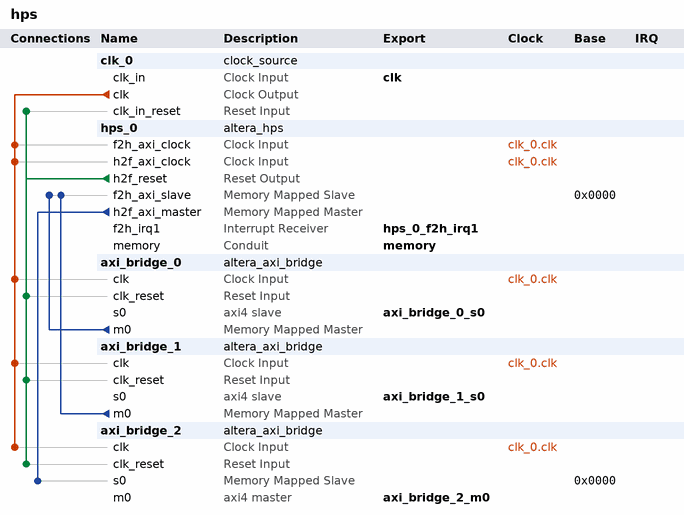
[diagram p0: system contents]
# Platform Designer (Qsys) system hps, Cyclone V 5CSEMA4U23C6
# Parameters at their usual value, and those the tool derives, are not listed.
package require -exact qsys 16.0
create_system hps
set_project_property DEVICE_FAMILY {Cyclone V}
set_project_property DEVICE 5CSEMA4U23C6

add_instance clk_0 clock_source 16.0
set_instance_parameter_value clk_0 clockFrequency 50000000

add_instance hps_0 altera_hps 16.0
set_instance_parameter_value hps_0 EMAC1_Mode N/A
set_instance_parameter_value hps_0 EMAC1_PinMuxing Unused
set_instance_parameter_value hps_0 F2SCLK_COLDRST_Enable false
set_instance_parameter_value hps_0 F2SCLK_DBGRST_Enable false
set_instance_parameter_value hps_0 F2SCLK_WARMRST_Enable false
set_instance_parameter_value hps_0 F2SINTERRUPT_Enable true
set_instance_parameter_value hps_0 F2S_Width 2
set_instance_parameter_value hps_0 FPGA_PERIPHERAL_OUTPUT_CLOCK_FREQ_EMAC0_GTX_CLK 125
set_instance_parameter_value hps_0 FPGA_PERIPHERAL_OUTPUT_CLOCK_FREQ_EMAC0_MD_CLK 2.5
set_instance_parameter_value hps_0 FPGA_PERIPHERAL_OUTPUT_CLOCK_FREQ_EMAC1_GTX_CLK 125
set_instance_parameter_value hps_0 FPGA_PERIPHERAL_OUTPUT_CLOCK_FREQ_EMAC1_MD_CLK 2.5
set_instance_parameter_value hps_0 HPS_PROTOCOL DDR3
set_instance_parameter_value hps_0 I2C0_Mode N/A
set_instance_parameter_value hps_0 I2C0_PinMuxing Unused
set_instance_parameter_value hps_0 I2C1_Mode N/A
set_instance_parameter_value hps_0 I2C1_PinMuxing Unused
set_instance_parameter_value hps_0 LWH2F_Enable false
set_instance_parameter_value hps_0 MEM_BANKADDR_WIDTH 3
set_instance_parameter_value hps_0 MEM_CLK_FREQ 300.0
set_instance_parameter_value hps_0 MEM_CLK_FREQ_MAX 400.0
set_instance_parameter_value hps_0 MEM_COL_ADDR_WIDTH 8
set_instance_parameter_value hps_0 MEM_DQ_WIDTH 32
set_instance_parameter_value hps_0 MEM_DRV_STR RZQ/6
set_instance_parameter_value hps_0 MEM_ROW_ADDR_WIDTH 12
set_instance_parameter_value hps_0 MEM_RTT_NOM {ODT Disabled}
set_instance_parameter_value hps_0 MEM_RTT_WR {Dynamic ODT off}
set_instance_parameter_value hps_0 MEM_TCL 7
set_instance_parameter_value hps_0 MEM_TFAW_NS 37.5
set_instance_parameter_value hps_0 MEM_TINIT_US 499
set_instance_parameter_value hps_0 MEM_TMRD_CK 3
set_instance_parameter_value hps_0 MEM_TRAS_NS 40.0
set_instance_parameter_value hps_0 MEM_TRCD_NS 15.0
set_instance_parameter_value hps_0 MEM_TREFI_US 7.0
set_instance_parameter_value hps_0 MEM_TRFC_NS 75.0
set_instance_parameter_value hps_0 MEM_TRP_NS 15.0
set_instance_parameter_value hps_0 MEM_TWTR 2
set_instance_parameter_value hps_0 MEM_VENDOR JEDEC
set_instance_parameter_value hps_0 MEM_WTCL 6
set_instance_parameter_value hps_0 QSPI_Mode N/A
set_instance_parameter_value hps_0 QSPI_PinMuxing Unused
set_instance_parameter_value hps_0 REF_CLK_FREQ 125.0
set_instance_parameter_value hps_0 S2FCLK_USER2CLK 5
set_instance_parameter_value hps_0 S2F_Width 1
set_instance_parameter_value hps_0 SDIO_Mode N/A
set_instance_parameter_value hps_0 SDIO_PinMuxing Unused
set_instance_parameter_value hps_0 SPIM1_Mode N/A
set_instance_parameter_value hps_0 SPIM1_PinMuxing Unused
set_instance_parameter_value hps_0 STM_Enable false
set_instance_parameter_value hps_0 TIMING_BOARD_AC_SKEW 0.02
set_instance_parameter_value hps_0 TIMING_BOARD_AC_TO_CK_SKEW 0.0
set_instance_parameter_value hps_0 TIMING_BOARD_DQ_TO_DQS_SKEW 0.0
set_instance_parameter_value hps_0 TIMING_BOARD_MAX_CK_DELAY 0.6
set_instance_parameter_value hps_0 TIMING_BOARD_MAX_DQS_DELAY 0.6
set_instance_parameter_value hps_0 TIMING_BOARD_SKEW_BETWEEN_DQS 0.02
set_instance_parameter_value hps_0 TIMING_BOARD_SKEW_CKDQS_DIMM_MAX 0.01
set_instance_parameter_value hps_0 TIMING_BOARD_SKEW_CKDQS_DIMM_MIN -0.01
set_instance_parameter_value hps_0 TIMING_BOARD_SKEW_WITHIN_DQS 0.02
set_instance_parameter_value hps_0 TIMING_TDH 125
set_instance_parameter_value hps_0 TIMING_TDQSCK 400
set_instance_parameter_value hps_0 TIMING_TDQSQ 120
set_instance_parameter_value hps_0 TIMING_TDS 50
set_instance_parameter_value hps_0 TIMING_TIH 250
set_instance_parameter_value hps_0 TIMING_TIS 175
set_instance_parameter_value hps_0 TIMING_TQSH 0.38
set_instance_parameter_value hps_0 UART0_Mode N/A
set_instance_parameter_value hps_0 UART0_PinMuxing Unused
set_instance_parameter_value hps_0 USB1_Mode N/A
set_instance_parameter_value hps_0 USB1_PinMuxing Unused
set_instance_parameter_value hps_0 desired_cfg_clk_mhz 100.0
set_instance_parameter_value hps_0 desired_qspi_clk_mhz 400.0

add_instance axi_bridge_0 altera_axi_bridge 16.0
set_instance_parameter_value axi_bridge_0 ADDR_WIDTH 40
set_instance_parameter_value axi_bridge_0 AXI_VERSION AXI4
set_instance_parameter_value axi_bridge_0 COMBINED_ACCEPTANCE_CAPABILITY 16
set_instance_parameter_value axi_bridge_0 COMBINED_ISSUING_CAPABILITY 16
set_instance_parameter_value axi_bridge_0 DATA_WIDTH 64
set_instance_parameter_value axi_bridge_0 M0_ID_WIDTH 7
set_instance_parameter_value axi_bridge_0 READ_ACCEPTANCE_CAPABILITY 16
set_instance_parameter_value axi_bridge_0 READ_ADDR_USER_WIDTH 64
set_instance_parameter_value axi_bridge_0 READ_DATA_REORDERING_DEPTH 1
set_instance_parameter_value axi_bridge_0 READ_DATA_USER_WIDTH 64
set_instance_parameter_value axi_bridge_0 READ_ISSUING_CAPABILITY 16
set_instance_parameter_value axi_bridge_0 S0_ID_WIDTH 7
set_instance_parameter_value axi_bridge_0 USE_M0_ARBURST 1
set_instance_parameter_value axi_bridge_0 USE_M0_ARCACHE 1
set_instance_parameter_value axi_bridge_0 USE_M0_ARID 1
set_instance_parameter_value axi_bridge_0 USE_M0_ARLEN 1
set_instance_parameter_value axi_bridge_0 USE_M0_ARLOCK 1
set_instance_parameter_value axi_bridge_0 USE_M0_ARQOS 1
set_instance_parameter_value axi_bridge_0 USE_M0_ARREGION 1
set_instance_parameter_value axi_bridge_0 USE_M0_ARSIZE 1
set_instance_parameter_value axi_bridge_0 USE_M0_ARUSER 0
set_instance_parameter_value axi_bridge_0 USE_M0_AWBURST 1
set_instance_parameter_value axi_bridge_0 USE_M0_AWCACHE 1
set_instance_parameter_value axi_bridge_0 USE_M0_AWID 1
set_instance_parameter_value axi_bridge_0 USE_M0_AWLEN 1
set_instance_parameter_value axi_bridge_0 USE_M0_AWLOCK 1
set_instance_parameter_value axi_bridge_0 USE_M0_AWQOS 1
set_instance_parameter_value axi_bridge_0 USE_M0_AWREGION 1
set_instance_parameter_value axi_bridge_0 USE_M0_AWSIZE 1
set_instance_parameter_value axi_bridge_0 USE_M0_AWUSER 0
set_instance_parameter_value axi_bridge_0 USE_M0_BID 1
set_instance_parameter_value axi_bridge_0 USE_M0_BRESP 1
set_instance_parameter_value axi_bridge_0 USE_M0_BUSER 0
set_instance_parameter_value axi_bridge_0 USE_M0_RID 1
set_instance_parameter_value axi_bridge_0 USE_M0_RLAST 1
set_instance_parameter_value axi_bridge_0 USE_M0_RRESP 1
set_instance_parameter_value axi_bridge_0 USE_M0_RUSER 0
set_instance_parameter_value axi_bridge_0 USE_M0_WSTRB 1
set_instance_parameter_value axi_bridge_0 USE_M0_WUSER 0
set_instance_parameter_value axi_bridge_0 USE_PIPELINE 1
set_instance_parameter_value axi_bridge_0 USE_S0_ARCACHE 1
set_instance_parameter_value axi_bridge_0 USE_S0_ARLOCK 1
set_instance_parameter_value axi_bridge_0 USE_S0_ARPROT 1
set_instance_parameter_value axi_bridge_0 USE_S0_ARQOS 0
set_instance_parameter_value axi_bridge_0 USE_S0_ARREGION 0
set_instance_parameter_value axi_bridge_0 USE_S0_ARUSER 0
set_instance_parameter_value axi_bridge_0 USE_S0_AWCACHE 1
set_instance_parameter_value axi_bridge_0 USE_S0_AWLOCK 1
set_instance_parameter_value axi_bridge_0 USE_S0_AWPROT 1
set_instance_parameter_value axi_bridge_0 USE_S0_AWQOS 0
set_instance_parameter_value axi_bridge_0 USE_S0_AWREGION 0
set_instance_parameter_value axi_bridge_0 USE_S0_AWUSER 0
set_instance_parameter_value axi_bridge_0 USE_S0_BRESP 1
set_instance_parameter_value axi_bridge_0 USE_S0_BUSER 0
set_instance_parameter_value axi_bridge_0 USE_S0_RRESP 1
set_instance_parameter_value axi_bridge_0 USE_S0_RUSER 0
set_instance_parameter_value axi_bridge_0 USE_S0_WLAST 1
set_instance_parameter_value axi_bridge_0 USE_S0_WUSER 0
set_instance_parameter_value axi_bridge_0 WRITE_ACCEPTANCE_CAPABILITY 16
set_instance_parameter_value axi_bridge_0 WRITE_ADDR_USER_WIDTH 64
set_instance_parameter_value axi_bridge_0 WRITE_DATA_USER_WIDTH 64
set_instance_parameter_value axi_bridge_0 WRITE_ISSUING_CAPABILITY 16
set_instance_parameter_value axi_bridge_0 WRITE_RESP_USER_WIDTH 64

add_instance axi_bridge_1 altera_axi_bridge 16.0
set_instance_parameter_value axi_bridge_1 ADDR_WIDTH 40
set_instance_parameter_value axi_bridge_1 AXI_VERSION AXI4
set_instance_parameter_value axi_bridge_1 COMBINED_ACCEPTANCE_CAPABILITY 16
set_instance_parameter_value axi_bridge_1 COMBINED_ISSUING_CAPABILITY 16
set_instance_parameter_value axi_bridge_1 DATA_WIDTH 64
set_instance_parameter_value axi_bridge_1 M0_ID_WIDTH 7
set_instance_parameter_value axi_bridge_1 READ_ACCEPTANCE_CAPABILITY 16
set_instance_parameter_value axi_bridge_1 READ_ADDR_USER_WIDTH 64
set_instance_parameter_value axi_bridge_1 READ_DATA_REORDERING_DEPTH 1
set_instance_parameter_value axi_bridge_1 READ_DATA_USER_WIDTH 64
set_instance_parameter_value axi_bridge_1 READ_ISSUING_CAPABILITY 16
set_instance_parameter_value axi_bridge_1 S0_ID_WIDTH 7
set_instance_parameter_value axi_bridge_1 USE_M0_ARBURST 1
set_instance_parameter_value axi_bridge_1 USE_M0_ARCACHE 1
set_instance_parameter_value axi_bridge_1 USE_M0_ARID 1
set_instance_parameter_value axi_bridge_1 USE_M0_ARLEN 1
set_instance_parameter_value axi_bridge_1 USE_M0_ARLOCK 1
set_instance_parameter_value axi_bridge_1 USE_M0_ARQOS 1
set_instance_parameter_value axi_bridge_1 USE_M0_ARREGION 1
set_instance_parameter_value axi_bridge_1 USE_M0_ARSIZE 1
set_instance_parameter_value axi_bridge_1 USE_M0_ARUSER 0
set_instance_parameter_value axi_bridge_1 USE_M0_AWBURST 1
set_instance_parameter_value axi_bridge_1 USE_M0_AWCACHE 1
set_instance_parameter_value axi_bridge_1 USE_M0_AWID 1
set_instance_parameter_value axi_bridge_1 USE_M0_AWLEN 1
set_instance_parameter_value axi_bridge_1 USE_M0_AWLOCK 1
set_instance_parameter_value axi_bridge_1 USE_M0_AWQOS 1
set_instance_parameter_value axi_bridge_1 USE_M0_AWREGION 1
set_instance_parameter_value axi_bridge_1 USE_M0_AWSIZE 1
set_instance_parameter_value axi_bridge_1 USE_M0_AWUSER 0
set_instance_parameter_value axi_bridge_1 USE_M0_BID 1
set_instance_parameter_value axi_bridge_1 USE_M0_BRESP 1
set_instance_parameter_value axi_bridge_1 USE_M0_BUSER 0
set_instance_parameter_value axi_bridge_1 USE_M0_RID 1
set_instance_parameter_value axi_bridge_1 USE_M0_RLAST 1
set_instance_parameter_value axi_bridge_1 USE_M0_RRESP 1
set_instance_parameter_value axi_bridge_1 USE_M0_RUSER 0
set_instance_parameter_value axi_bridge_1 USE_M0_WSTRB 1
set_instance_parameter_value axi_bridge_1 USE_M0_WUSER 0
set_instance_parameter_value axi_bridge_1 USE_PIPELINE 1
set_instance_parameter_value axi_bridge_1 USE_S0_ARCACHE 1
set_instance_parameter_value axi_bridge_1 USE_S0_ARLOCK 1
set_instance_parameter_value axi_bridge_1 USE_S0_ARPROT 1
set_instance_parameter_value axi_bridge_1 USE_S0_ARQOS 0
set_instance_parameter_value axi_bridge_1 USE_S0_ARREGION 0
set_instance_parameter_value axi_bridge_1 USE_S0_ARUSER 0
set_instance_parameter_value axi_bridge_1 USE_S0_AWCACHE 1
set_instance_parameter_value axi_bridge_1 USE_S0_AWLOCK 1
set_instance_parameter_value axi_bridge_1 USE_S0_AWPROT 1
set_instance_parameter_value axi_bridge_1 USE_S0_AWQOS 0
set_instance_parameter_value axi_bridge_1 USE_S0_AWREGION 0
set_instance_parameter_value axi_bridge_1 USE_S0_AWUSER 0
set_instance_parameter_value axi_bridge_1 USE_S0_BRESP 1
set_instance_parameter_value axi_bridge_1 USE_S0_BUSER 0
set_instance_parameter_value axi_bridge_1 USE_S0_RRESP 1
set_instance_parameter_value axi_bridge_1 USE_S0_RUSER 0
set_instance_parameter_value axi_bridge_1 USE_S0_WLAST 1
set_instance_parameter_value axi_bridge_1 USE_S0_WUSER 0
set_instance_parameter_value axi_bridge_1 WRITE_ACCEPTANCE_CAPABILITY 16
set_instance_parameter_value axi_bridge_1 WRITE_ADDR_USER_WIDTH 64
set_instance_parameter_value axi_bridge_1 WRITE_DATA_USER_WIDTH 64
set_instance_parameter_value axi_bridge_1 WRITE_ISSUING_CAPABILITY 16
set_instance_parameter_value axi_bridge_1 WRITE_RESP_USER_WIDTH 64

add_instance axi_bridge_2 altera_axi_bridge 16.0
set_instance_parameter_value axi_bridge_2 ADDR_WIDTH 12
set_instance_parameter_value axi_bridge_2 AXI_VERSION AXI4
set_instance_parameter_value axi_bridge_2 COMBINED_ACCEPTANCE_CAPABILITY 16
set_instance_parameter_value axi_bridge_2 COMBINED_ISSUING_CAPABILITY 16
set_instance_parameter_value axi_bridge_2 DATA_WIDTH 32
set_instance_parameter_value axi_bridge_2 M0_ID_WIDTH 7
set_instance_parameter_value axi_bridge_2 READ_ACCEPTANCE_CAPABILITY 16
set_instance_parameter_value axi_bridge_2 READ_ADDR_USER_WIDTH 64
set_instance_parameter_value axi_bridge_2 READ_DATA_REORDERING_DEPTH 1
set_instance_parameter_value axi_bridge_2 READ_DATA_USER_WIDTH 64
set_instance_parameter_value axi_bridge_2 READ_ISSUING_CAPABILITY 16
set_instance_parameter_value axi_bridge_2 S0_ID_WIDTH 12
set_instance_parameter_value axi_bridge_2 USE_M0_ARBURST 1
set_instance_parameter_value axi_bridge_2 USE_M0_ARCACHE 1
set_instance_parameter_value axi_bridge_2 USE_M0_ARID 1
set_instance_parameter_value axi_bridge_2 USE_M0_ARLEN 1
set_instance_parameter_value axi_bridge_2 USE_M0_ARLOCK 1
set_instance_parameter_value axi_bridge_2 USE_M0_ARQOS 0
set_instance_parameter_value axi_bridge_2 USE_M0_ARREGION 0
set_instance_parameter_value axi_bridge_2 USE_M0_ARSIZE 1
set_instance_parameter_value axi_bridge_2 USE_M0_ARUSER 0
set_instance_parameter_value axi_bridge_2 USE_M0_AWBURST 1
set_instance_parameter_value axi_bridge_2 USE_M0_AWCACHE 1
set_instance_parameter_value axi_bridge_2 USE_M0_AWID 1
set_instance_parameter_value axi_bridge_2 USE_M0_AWLEN 1
set_instance_parameter_value axi_bridge_2 USE_M0_AWLOCK 1
set_instance_parameter_value axi_bridge_2 USE_M0_AWQOS 0
set_instance_parameter_value axi_bridge_2 USE_M0_AWREGION 0
set_instance_parameter_value axi_bridge_2 USE_M0_AWSIZE 1
set_instance_parameter_value axi_bridge_2 USE_M0_AWUSER 0
set_instance_parameter_value axi_bridge_2 USE_M0_BID 1
set_instance_parameter_value axi_bridge_2 USE_M0_BRESP 1
set_instance_parameter_value axi_bridge_2 USE_M0_BUSER 0
set_instance_parameter_value axi_bridge_2 USE_M0_RID 1
set_instance_parameter_value axi_bridge_2 USE_M0_RLAST 1
set_instance_parameter_value axi_bridge_2 USE_M0_RRESP 1
set_instance_parameter_value axi_bridge_2 USE_M0_RUSER 0
set_instance_parameter_value axi_bridge_2 USE_M0_WSTRB 1
set_instance_parameter_value axi_bridge_2 USE_M0_WUSER 0
set_instance_parameter_value axi_bridge_2 USE_PIPELINE 1
set_instance_parameter_value axi_bridge_2 USE_S0_ARCACHE 1
set_instance_parameter_value axi_bridge_2 USE_S0_ARLOCK 1
set_instance_parameter_value axi_bridge_2 USE_S0_ARPROT 1
set_instance_parameter_value axi_bridge_2 USE_S0_ARQOS 0
set_instance_parameter_value axi_bridge_2 USE_S0_ARREGION 0
set_instance_parameter_value axi_bridge_2 USE_S0_ARUSER 0
set_instance_parameter_value axi_bridge_2 USE_S0_AWCACHE 1
set_instance_parameter_value axi_bridge_2 USE_S0_AWLOCK 1
set_instance_parameter_value axi_bridge_2 USE_S0_AWPROT 1
set_instance_parameter_value axi_bridge_2 USE_S0_AWQOS 0
set_instance_parameter_value axi_bridge_2 USE_S0_AWREGION 0
set_instance_parameter_value axi_bridge_2 USE_S0_AWUSER 0
set_instance_parameter_value axi_bridge_2 USE_S0_BRESP 1
set_instance_parameter_value axi_bridge_2 USE_S0_BUSER 0
set_instance_parameter_value axi_bridge_2 USE_S0_RRESP 1
set_instance_parameter_value axi_bridge_2 USE_S0_RUSER 0
set_instance_parameter_value axi_bridge_2 USE_S0_WLAST 1
set_instance_parameter_value axi_bridge_2 USE_S0_WUSER 0
set_instance_parameter_value axi_bridge_2 WRITE_ACCEPTANCE_CAPABILITY 16
set_instance_parameter_value axi_bridge_2 WRITE_ADDR_USER_WIDTH 64
set_instance_parameter_value axi_bridge_2 WRITE_DATA_USER_WIDTH 64
set_instance_parameter_value axi_bridge_2 WRITE_ISSUING_CAPABILITY 16
set_instance_parameter_value axi_bridge_2 WRITE_RESP_USER_WIDTH 64

# connections
add_connection clk_0.clk axi_bridge_0.clk clock
add_connection clk_0.clk axi_bridge_1.clk clock
add_connection clk_0.clk axi_bridge_2.clk clock
add_connection clk_0.clk hps_0.f2h_axi_clock clock
add_connection clk_0.clk hps_0.h2f_axi_clock clock
add_connection hps_0.h2f_reset axi_bridge_0.clk_reset reset
add_connection hps_0.h2f_reset axi_bridge_1.clk_reset reset
add_connection hps_0.h2f_reset axi_bridge_2.clk_reset reset
add_connection hps_0.h2f_reset clk_0.clk_in_reset reset
add_connection axi_bridge_0.m0 hps_0.f2h_axi_slave avalon
set_connection_parameter_value axi_bridge_0.m0/hps_0.f2h_axi_slave baseAddress 0x0000
add_connection axi_bridge_1.m0 hps_0.f2h_axi_slave avalon
set_connection_parameter_value axi_bridge_1.m0/hps_0.f2h_axi_slave baseAddress 0x0000
add_connection hps_0.h2f_axi_master axi_bridge_2.s0 avalon
set_connection_parameter_value hps_0.h2f_axi_master/axi_bridge_2.s0 baseAddress 0x0000

# exported interfaces
add_interface axi_bridge_0_s0 axi4 slave
set_interface_property axi_bridge_0_s0 EXPORT_OF axi_bridge_0.s0
add_interface axi_bridge_1_s0 axi4 slave
set_interface_property axi_bridge_1_s0 EXPORT_OF axi_bridge_1.s0
add_interface axi_bridge_2_m0 axi4 master
set_interface_property axi_bridge_2_m0 EXPORT_OF axi_bridge_2.m0
add_interface clk clock sink
set_interface_property clk EXPORT_OF clk_0.clk_in
add_interface hps_0_f2h_irq1 interrupt receiver
set_interface_property hps_0_f2h_irq1 EXPORT_OF hps_0.f2h_irq1
add_interface memory conduit end
set_interface_property memory EXPORT_OF hps_0.memory

set_interconnect_requirement {$system} qsys_mm.clockCrossingAdapter HANDSHAKE
set_interconnect_requirement {$system} qsys_mm.enableEccProtection FALSE
set_interconnect_requirement {$system} qsys_mm.insertDefaultSlave FALSE
set_interconnect_requirement {$system} qsys_mm.maxAdditionalLatency 1

save_system hps.qsys
